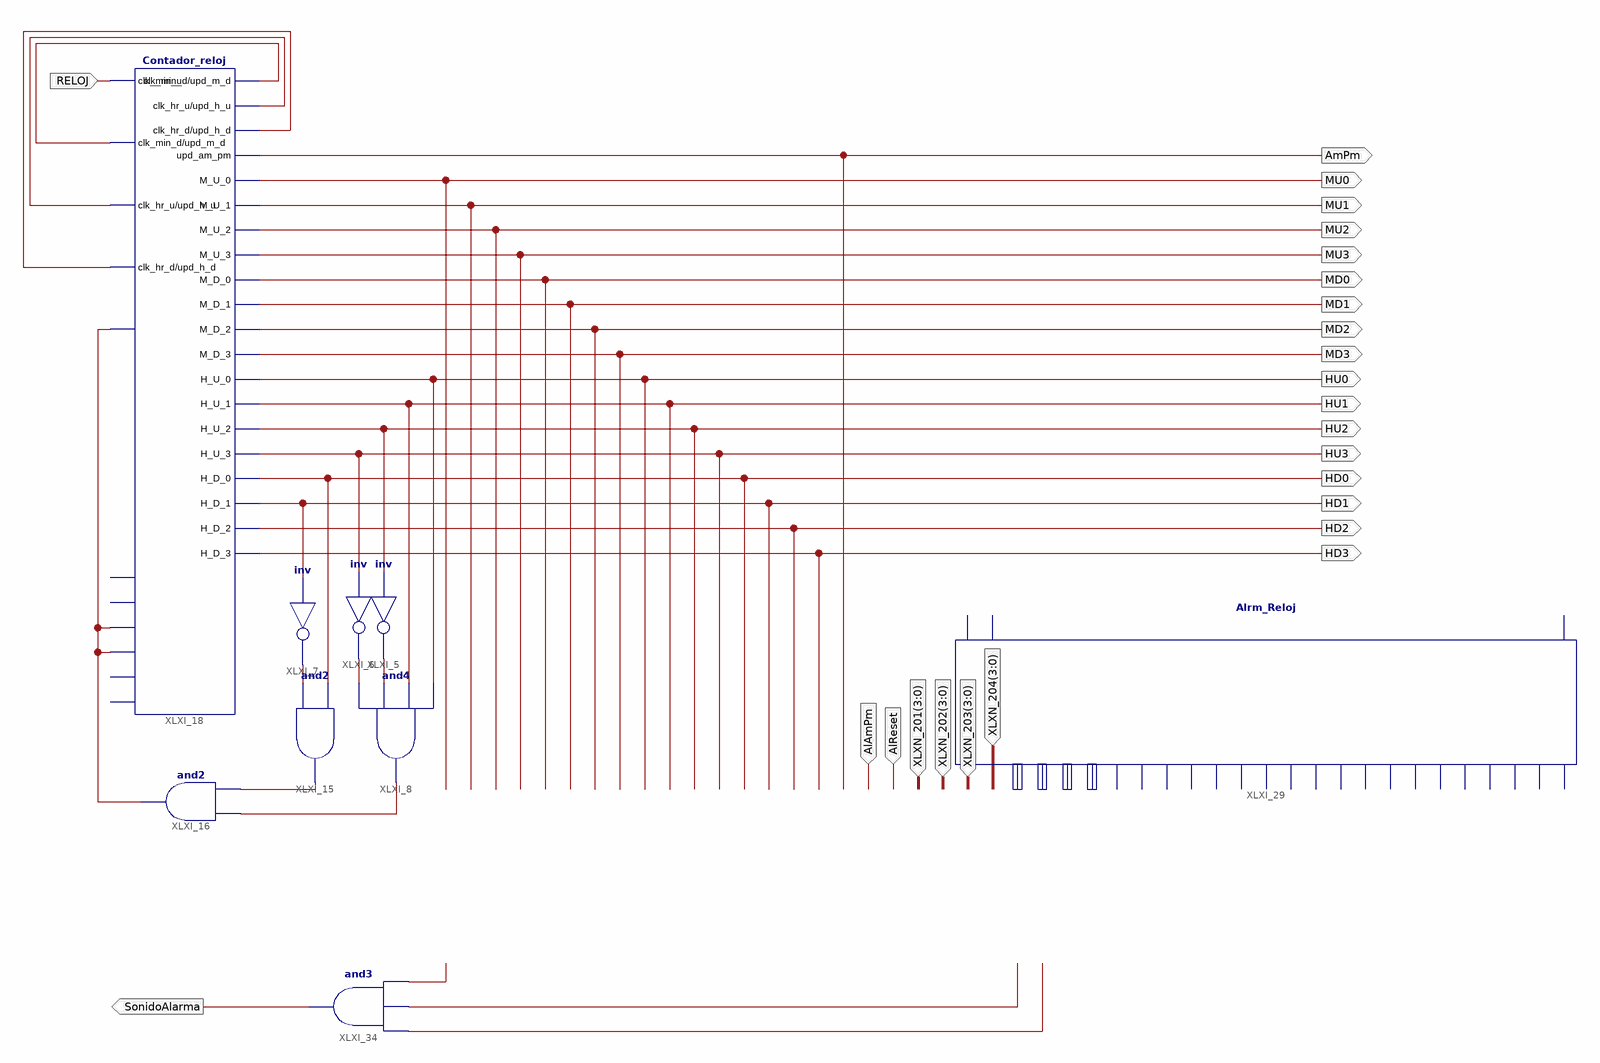
[diagram p0: schematic sheet 1]
// Xilinx ISE schematic Esquema.sch (spartan3) as structural Verilog: 9 symbols, 25 ports
module Esquema (
  input  RELOJ,
  input  AlReset,
  input  AlAmPm,
  input  [3:0] XLXN_201,
  input  [3:0] XLXN_202,
  input  [3:0] XLXN_203,
  input  [3:0] XLXN_204,
  output HU0,
  output HU1,
  output HU3,
  output HD0,
  output HD1,
  output HU2,
  output HD3,
  output MD3,
  output MD2,
  output MD1,
  output MD0,
  output MU2,
  output MU3,
  output MU1,
  output HD2,
  output MU0,
  output AmPm,
  output SonidoAlarma
);

  wire XLXN_4, XLXN_7, XLXN_9, XLXN_30, XLXN_31, XLXN_57, XLXN_58, XLXN_59, XLXN_68, XLXN_211, XLXN_212,
       XLXN_213;

  not XLXI_7 (XLXN_57, HD1);
  and XLXI_8 (XLXN_59, XLXN_30, XLXN_31, HU1, HU0);
  not XLXI_6 (XLXN_30, HU3);
  not XLXI_5 (XLXN_31, HU2);
  and XLXI_15 (XLXN_58, XLXN_57, HD0);
  and XLXI_16 (XLXN_68, XLXN_59, XLXN_58);
  Contador_reloj XLXI_18 (
    .clk_min_u(RELOJ), .clk_min_d(XLXN_4), .clk_hr_u(XLXN_7), .clk_hr_d(XLXN_9), .clk_am_pm(XLXN_68),
    .areset_min_d(XLXN_68), .areset_hr_u(XLXN_68), .upd_m_d(XLXN_4), .upd_h_u(XLXN_7), .upd_h_d(XLXN_9),
    .upd_am_pm(AmPm), .M_U_0(MU0), .M_U_1(MU1), .M_U_2(MU2), .M_U_3(MU3), .M_D_0(MD0), .M_D_1(MD1),
    .M_D_2(MD2), .M_D_3(MD3), .H_U_0(HU0), .H_U_1(HU1), .H_U_2(HU2), .H_U_3(HU3), .H_D_0(HD0), .H_D_1(HD1),
    .H_D_2(HD2), .H_D_3(HD3));  // open: clk_doce, areset_min_u, areset_hr_d, areset_am_pm
  Alrm_Reloj XLXI_29 (
    .Rlj_Min_U_0(MU0), .Rlj_Min_U_1(MU1), .Rlj_Min_U_2(MU2), .Rlj_Min_U_3(MU3), .Rlj_Min_D_0(MD0),
    .Rlj_Min_D_1(MD1), .Rlj_Min_D_2(MD2), .Rlj_Min_D_3(MD3), .Rlj_Hr_U_0(HU0), .Rlj_Hr_U_1(HU1),
    .Rlj_Hr_U_2(HU2), .Rlj_Hr_U_3(HU3), .Rlj_Hr_D_0(HD0), .Rlj_Hr_D_1(HD1), .Rlj_Hr_D_2(HD2),
    .Rlj_Hr_D_3(HD3), .Rlj_Am_Pm(AmPm), .Alm_Am_Pm(AlAmPm), .Alm_Rst(AlReset), .Alm_Min_U(XLXN_201),
    .Alm_Min_D(XLXN_202), .Alm_Hr_U(XLXN_203), .Alm_Hr_D(XLXN_204), .Sen_1(XLXN_212), .Sen_2(XLXN_213),
    .Sen_3(XLXN_211));
  and XLXI_34 (SonidoAlarma, XLXN_213, XLXN_212, XLXN_211);
endmodule
